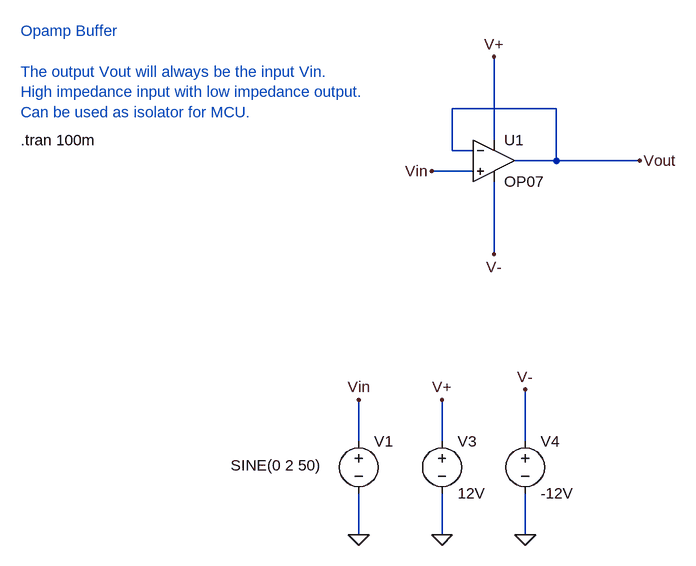
[diagram p0: schematic opamp_buffer.asc]
opamp_buffer.asc, the LTspice schematic file:
Version 4
SHEET 1 880 680
WIRE 336 -320 176 -320
WIRE 240 -272 240 -400
WIRE 176 -256 176 -320
WIRE 208 -256 176 -256
WIRE 336 -240 336 -320
WIRE 336 -240 272 -240
WIRE 464 -240 336 -240
WIRE 208 -224 144 -224
WIRE 240 -96 240 -208
WIRE 32 192 32 128
WIRE 160 192 160 128
WIRE 288 192 288 112
WIRE 32 336 32 272
WIRE 160 336 160 272
WIRE 288 336 288 272
FLAG 32 336 0
FLAG 160 336 0
FLAG 288 336 0
FLAG 160 128 V+
FLAG 288 112 V-
FLAG 240 -400 V+
FLAG 32 128 Vin
FLAG 240 -96 V-
FLAG 464 -240 Vout
FLAG 144 -224 Vin
SYMBOL voltage 32 176 R0
WINDOW 123 0 0 Left 0
WINDOW 39 0 0 Left 0
WINDOW 3 -197 53 Left 2
SYMATTR InstName V1
SYMATTR Value SINE(0 2 50)
SYMBOL OpAmps\\OP07 240 -304 R0
SYMATTR InstName U1
SYMBOL voltage 160 176 R0
WINDOW 123 0 0 Left 0
WINDOW 39 0 0 Left 0
SYMATTR InstName V3
SYMATTR Value 12V
SYMBOL voltage 288 176 R0
WINDOW 123 0 0 Left 0
WINDOW 39 0 0 Left 0
SYMATTR InstName V4
SYMATTR Value -12V
TEXT -488 -272 Left 2 !.tran 100m
TEXT -488 -440 Left 2 ;Opamp Buffer\n \nThe output Vout will always be the input Vin.\nHigh impedance input with low impedance output. \nCan be used as isolator for MCU.

The netlist it stands for:
* opamp_buffer.asc
V1 Vin 0 SINE(0 2 50)
XU1 Vin Vout V+ V- Vout LT1001  ; OP07, pins In+ In- V+ V- OUT
V3 V+ 0 12V
V4 V- 0 -12V
.tran 100m
* Opamp Buffer
* The output Vout will always be the input Vin.
* High impedance input with low impedance output.
* Can be used as isolator for MCU.
.lib LTC.lib
.backanno
.end